# EAGLE design PicoElf (EAGLE 4.11)
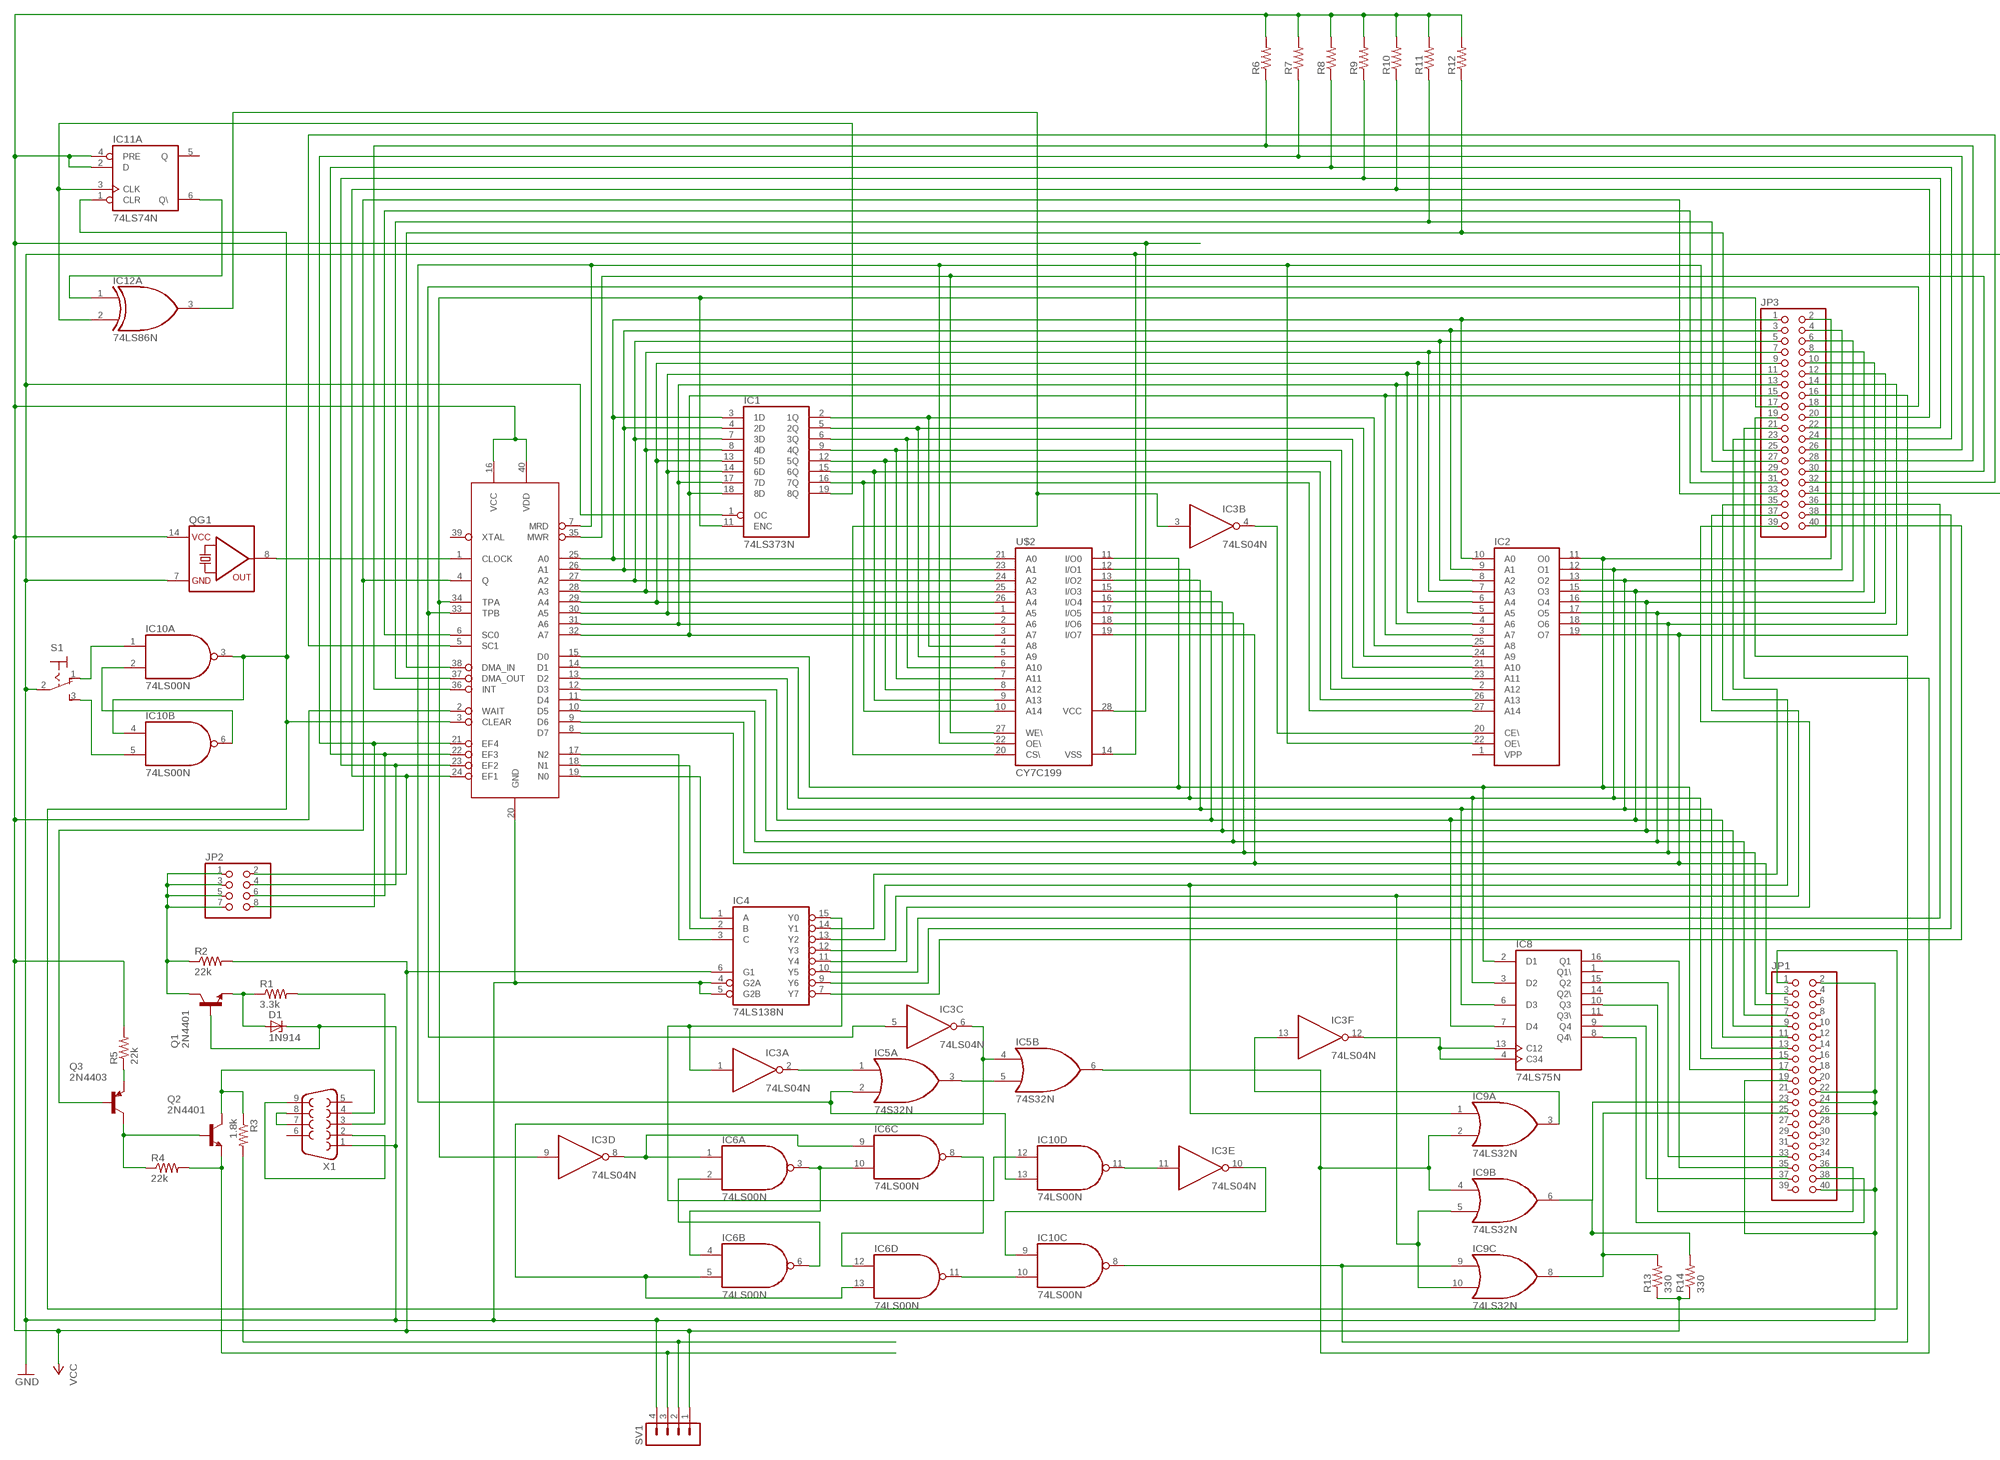
[diagram p0: schematic, sheet 1]

## Parts
D1  1N914  1N821  [DO35Z10]
IC1  74LS373N  [DIL20]
IC2  27256  [DIL28]
IC3  74LS04N  [DIL14]
IC4  74LS138N  [DIL16]
IC5  74S32N  [DIL14]
IC6  74LS00N  [DIL14]
IC8  74LS75N  [DIL16]
IC9  74LS32N  [DIL14]
IC10  74LS00N  [DIL14]
IC11  74LS74N  [DIL14]
IC12  74LS86N  [DIL14]
JP1  PINHD-2X20  [2X20]
JP2  PINHD-2X4  [2X04]
JP3  PINHD-2X20  [2X20]
Q1  2N4401  2N3565  [TO92]
Q2  2N4401  2N3565  [TO92]
Q3  2N4403  2N3906  [TO92]
QG1  QG5860  [DIL14S]
R1  3.3k  R-US_0207/5V  [0207/5V]
R2  22k  R-US_0207/5V  [0207/5V]
R3  1.8k  R-US_0207/5V  [0207/5V]
R4  22k  R-US_0207/5V  [0207/5V]
R5  22k  R-US_0207/5V  [0207/5V]
R6  R-US_0207/2V  [0207/2V]
R7  R-US_0207/2V  [0207/2V]
R8  R-US_0207/2V  [0207/2V]
R9  R-US_0207/2V  [0207/2V]
R10  R-US_0207/2V  [0207/2V]
R11  R-US_0207/2V  [0207/2V]
R12  R-US_0207/2V  [0207/2V]
R13  330  R-US_0207/2V  [0207/2V]
R14  330  R-US_0207/2V  [0207/2V]
S1  320-916  [320-916]
SV1  MA04-1  [MA04-1]
U$1  CDP1802BCECDP1802BCE  [DIL40]
U$2  CY7C199  [DIL28-3]
X1  F09H  [F09H]

## Nets
+12V: R3.2 SV1.2
-12V: Q2.3(E) R4.2 SV1.3
A0: IC1.3(1D) IC2.10(A0) JP3.1 U$1.25(A0) U$2.21(A0)
A1: IC1.4(2D) IC2.9(A1) JP3.3 U$1.26(A1) U$2.23(A1)
A2: IC1.7(3D) IC2.8(A2) JP3.5 U$1.27(A2) U$2.24(A2)
A3: IC1.8(4D) IC2.7(A3) JP3.7 U$1.28(A3) U$2.25(A3)
A4: IC1.13(5D) IC2.6(A4) JP3.9 U$1.29(A4) U$2.26(A4)
A5: IC1.14(6D) IC2.5(A5) JP3.11 U$1.30(A5) U$2.1(A5)
A6: IC1.17(7D) IC2.4(A6) JP3.13 U$1.31(A6) U$2.2(A6)
A7: IC1.18(8D) IC2.3(A7) JP3.15 U$1.32(A7) U$2.3(A7)
A8: IC1.2(1Q) IC2.25(A8) U$2.4(A8)
A9: IC1.5(2Q) IC2.24(A9) U$2.5(A9)
A10: IC1.6(3Q) IC2.21(A10) U$2.6(A10)
A11: IC1.9(4Q) IC2.23(A11) U$2.7(A11)
A12: IC1.12(5Q) IC2.2(A12) U$2.8(A12)
A13: IC1.15(6Q) IC2.26(A13) U$2.9(A13)
A14: IC1.16(7Q) IC2.27(A14) U$2.10(A14)
A15: IC1.19(8Q) IC11.3(A:CLK) IC12.2(A:I1)
CLOCK: QG1.8(OUT) U$1.1(CLOCK)
D0: IC2.11(O0) IC8.2(D1) JP1.17 JP3.2 U$1.15(D0) U$2.11(I/O0)
D1: IC2.12(O1) IC8.3(D2) JP1.15 JP3.4 U$1.14(D1) U$2.12(I/O1)
D2: IC2.13(O2) IC8.6(D3) JP1.13 JP3.6 U$1.13(D2) U$2.13(I/O2)
D3: IC2.15(O3) IC8.7(D4) JP1.11 JP3.8 U$1.12(D3) U$2.15(I/O3)
D4: IC2.16(O4) JP1.9 JP3.10 U$1.11(D4) U$2.16(I/O4)
D5: IC2.17(O5) JP1.7 JP3.12 U$1.10(D5) U$2.17(I/O5)
D6: IC2.18(O6) JP1.5 JP3.14 U$1.9(D6) U$2.18(I/O6)
D7: IC2.19(O7) JP1.3 JP3.16 U$1.8(D7) U$2.19(I/O7)
DMA_IN: JP3.25 R12.1 U$1.38(DMA_IN)
DMA_OUT: JP3.27 R11.1 U$1.37(DMA_OUT)
EF1: JP2.2 JP3.20 R10.1 U$1.24(EF1)
EF2: JP2.4 JP3.22 R9.1 U$1.23(EF2)
EF3: JP2.6 JP3.24 R8.1 U$1.22(EF3)
EF4: JP2.8 JP3.26 R7.1 U$1.21(EF4)
GND: D1.C IC1.1(OC) IC4.4(G2A) IC4.5(G2B) JP1.2 JP1.19 JP1.22 JP1.24 JP1.26 JP1.40 JP3.34 Q1.2(B) QG1.7(GND) S1.2(P) SV1.4 U$1.20(GND) U$2.14(VSS) X1.1
INP: IC9.9(C:I0) IC10.8(C:O) JP3.19
INT: JP3.28 R6.1 U$1.36(INT)
MRD: IC2.22(OE\) IC5.2(A:I1) IC10.13(D:I1) JP3.29 U$1.7(MRD) U$2.22(OE\)
MWR: JP3.30 U$1.35(MWR) U$2.27(WE\)
N$1: IC2.20(CE\) IC3.4(B:O)
N$2: IC11.6(A:Q\) IC12.1(A:I0)
N$3: IC4.1(A) U$1.19(N0)
N$4: IC4.2(B) U$1.18(N1)
N$5: IC4.3(C) U$1.17(N2)
N$6: IC3.1(A:I) IC4.15(Y0) IC10.12(D:I0)
N$7: IC3.2(A:O) IC5.1(A:I0)
N$8: IC6.3(A:O) IC6.4(B:I0) IC6.10(C:I1)
N$9: IC5.3(A:O) IC5.5(B:I1)
N$10: IC3.6(C:O) IC5.4(B:I0) IC6.5(B:I1) IC6.13(D:I1)
N$11: IC6.2(A:I1) IC6.6(B:O)
N$12: IC3.8(D:O) IC6.1(A:I0) IC6.9(C:I0)
N$13: IC3.10(E:O) IC10.9(C:I0)
N$14: IC6.8(C:O) IC6.12(D:I0)
N$15: IC3.13(F:I) IC9.3(A:O)
N$16: IC6.11(D:O) IC10.10(C:I1)
N$17: IC3.11(E:I) IC10.11(D:O)
N$19: JP3.32 U$1.5(SC1)
N$20: IC3.3(B:I) IC12.3(A:O) U$2.20(CS\)
N$23: IC3.12(F:O) IC8.4(C34) IC8.13(C12)
N$24: IC8.16(Q1) JP1.35
N$25: IC8.15(Q2) JP1.33
N$26: IC8.10(Q3) JP1.36
N$27: IC8.9(Q4) JP1.37
N$28: IC8.8(Q4\) JP1.38
N$29: IC9.6(B:O) JP1.23 R14.2
N$30: IC9.8(C:O) JP1.25 R13.2
N$31: D1.A Q1.3(E) R1.1
N$32: R1.2 X1.3
N$33: IC10.1(A:I0) S1.1(O)
N$35: X1.7 X1.8
N$36: X1.2 X1.9
N$37: JP2.1 JP2.3 JP2.5 JP2.7 Q1.1(C) R2.1
N$40: Q2.1(C) R3.1 X1.4
N$41: Q3.3(E) R5.1
N$42: Q2.2(B) Q3.1(C) R4.1
N$43: IC10.5(B:I1) S1.3(S)
N$46: IC10.2(A:I1) IC10.6(B:O)
OUT: IC5.6(B:O) IC9.2(A:I1) IC9.4(B:I0) JP3.21
PORT1: IC4.14(Y1) JP3.23
PORT2: IC4.13(Y2) IC9.1(A:I0) JP3.35
PORT3: IC4.12(Y3) IC9.5(B:I1) IC9.10(C:I1) JP3.37
PORT4: IC4.11(Y4) JP3.39
PORT5: IC4.10(Y5) JP3.36
PORT6: IC4.9(Y6) JP3.38
PORT7: IC4.7(Y7) JP3.40
Q: JP3.33 Q3.2(B) U$1.4(Q)
RESET: IC10.3(A:O) IC10.4(B:I0) IC11.1(A:CLR) JP1.1 U$1.3(CLEAR)
SC0: JP3.31 U$1.6(SC0)
TPA: IC1.11(ENC) IC3.9(D:I) JP3.17 U$1.34(TPA)
TPB: IC3.5(C:I) JP3.18 U$1.33(TPB)
VCC: IC4.6(G1) IC11.2(A:D) IC11.4(A:PRE) QG1.14(VCC) R2.2 R5.2 R6.2 R7.2 R8.2 R9.2 R10.2 R11.2 R12.2 R13.1 R14.1 SV1.1 U$1.2(WAIT) U$1.16(VCC) U$1.40(VDD) U$2.28(VCC)
Unconnected: IC2.1(VPP) IC5.8(C:O) IC5.9(C:I0) IC5.10(C:I1) IC5.11(D:O) IC5.12(D:I0) IC5.13(D:I1) IC8.1(Q1\) IC8.11(Q3\) IC8.14(Q2\) IC9.11(D:O) IC9.12(D:I0) IC9.13(D:I1) IC11.5(A:Q) IC11.8(B:Q\) IC11.9(B:Q) IC11.10(B:PRE) IC11.11(B:CLK) IC11.12(B:D) IC11.13(B:CLR) IC12.4(B:I0) IC12.5(B:I1) IC12.6(B:O) IC12.8(C:O) IC12.9(C:I0) IC12.10(C:I1) IC12.11(D:O) IC12.12(D:I0) IC12.13(D:I1) JP1.4 JP1.6 JP1.8 JP1.10 JP1.12 JP1.14 JP1.16 JP1.18 JP1.20 JP1.21 JP1.27 JP1.28 JP1.29 JP1.30 JP1.31 JP1.32 JP1.34 JP1.39 U$1.39(XTAL) X1.5 X1.6

## Power pins joined to a net without a drawn wire
GND: IC1.10(GND) IC2.14(GND) IC3.7(P:GND) IC4.8(GND) IC5.7(P:GND) IC6.7(P:GND) IC8.12(GND) IC9.7(P:GND) IC10.7(P:GND) IC11.7(P:GND) IC12.7(P:GND)
N$18: IC1.20(VCC) IC2.28(VCC) IC3.14(P:VCC) IC4.16(VCC) IC5.14(P:VCC) IC6.14(P:VCC) IC8.5(VCC) IC9.14(P:VCC) IC10.14(P:VCC) IC11.14(P:VCC) IC12.14(P:VCC)

## Library data of the parts
D1 = diode:1N821: Reference DIODE temperature compensated, 6,2 V
IC1 = 74xx-us:74*373: Octal D type transparent LATCH, edge triggered
IC2 = memory:27256: MEMORY
IC3 = 74xx-us:74*04: Hex INVERTER
IC4 = 74xx-us:74*138: 3-line to 8-line DECODER/DEMULTIPLEXER
IC5 IC9 = 74xx-us:74*32: Quad 2-input OR gate
IC6 IC10 = 74xx-us:74*00: Quad 2-input NAND gate
IC8 = 74xx-us:74*75: 4-bit bistable LATCH
IC11 = 74xx-us:74*74: Dual D type positive edge triggered FLIP FLOP, preset and clear
IC12 = 74xx-us:74*86: Quad 2-input EXCLUSIV-OR (XOR) gate
JP1 JP3 = pinhead:PINHD-2X20: PIN HEADER
JP2 = pinhead:PINHD-2X4: PIN HEADER
Q1 Q2 = transistor-npn:2N3565: NPN Transistor
Q3 = transistor-pnp:2N3906: PNP Transistor
QG1 = crystal:QG5860: CRYSTAL RESONATOR
R1-R14 = rcl:R-US_: RESISTOR, American symbol
S1 = switch:320-916: TOGGLE SWITCH distributor RS Components
SV1 = con-lstb:MA04-1: PIN HEADER
U$1 = cdp:CDP1802BCE
U$2 = cdp:CY7C199
X1 = con-subd:F09: SUB-D

## Board
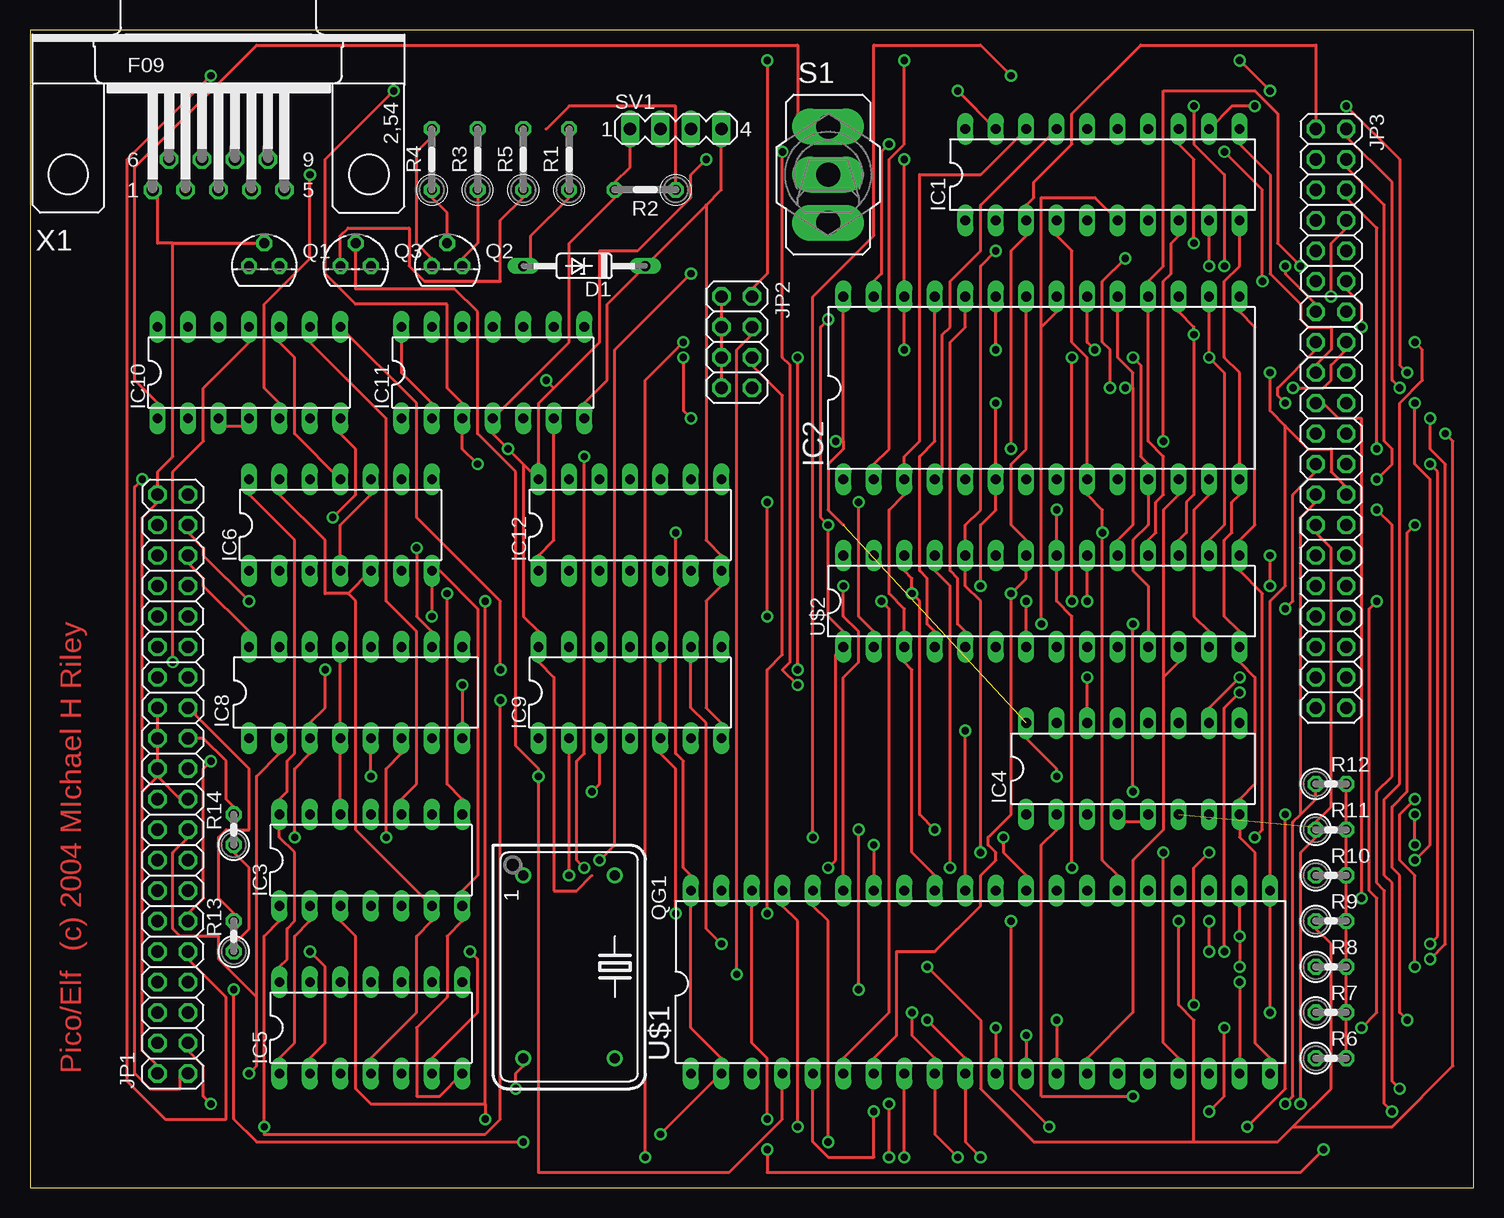
[diagram p1: board, top side]
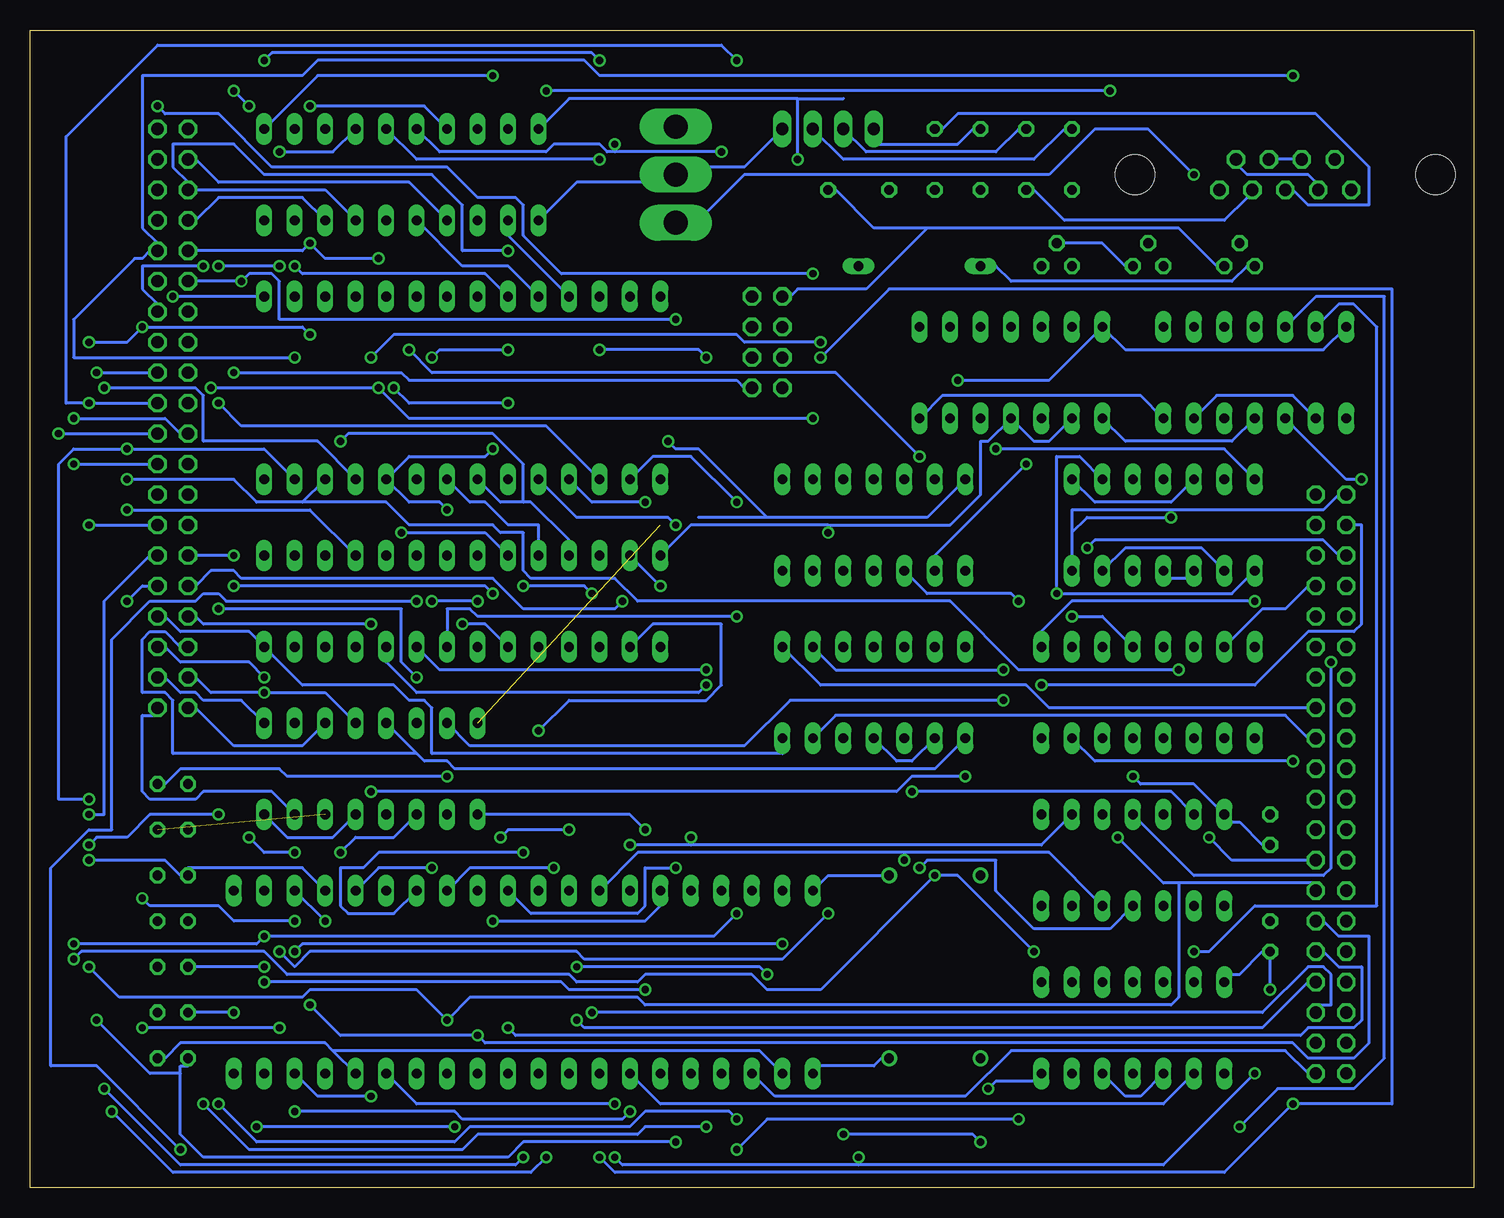
[diagram p2: board, bottom side, seen from below]

Size 120.32 x 96.51 mm. Coordinates in mm from the lower left corner, seen from the top.
Outline: 0,0 120.32,0 120.32,96.51 0,96.51 0,0
Copper layers (1*16): Top 0.035mm / dielectric 1.5mm / Bottom 0.035mm
Design rules "default": minimum track width 10mil, minimum drill 24mil, track to track 8mil, track to pad 8mil, pad to pad 8mil, via to via 8mil, smd to smd 8mil, copper to edge 40mil, drill to drill 8mil, minimum pad ring 10mil, minimum via ring 8mil, stop-mask expansion 4mil, vias tented up to drill 0mil, thermal gap 10mil

### Footprints (pad centres in the part's own frame; a part is rotated, then mirrored left to right if it is on the bottom)
DO35Z10 = drill 0.813 long: A 5.08,0; C -5.08,0
DIL20 = drill 0.813 long: 1 -11.43,-3.81; 2 -8.89,-3.81; 3 -6.35,-3.81; 4 -3.81,-3.81; 5 -1.27,-3.81; 6 1.27,-3.81; 7 3.81,-3.81; 8 6.35,-3.81; 9 8.89,-3.81; 10 11.43,-3.81; 11 11.43,3.81; 12 8.89,3.81; 13 6.35,3.81; 14 3.81,3.81; 15 1.27,3.81; 16 -1.27,3.81; 17 -3.81,3.81; 18 -6.35,3.81; 19 -8.89,3.81; 20 -11.43,3.81
DIL28 = drill 0.813 long: 1 -16.51,-7.62; 2 -13.97,-7.62; 3 -11.43,-7.62; 4 -8.89,-7.62; 5 -6.35,-7.62; 6 -3.81,-7.62; 7 -1.27,-7.62; 8 1.27,-7.62; 9 3.81,-7.62; 10 6.35,-7.62; 11 8.89,-7.62; 12 11.43,-7.62; 13 13.97,-7.62; 14 16.51,-7.62; 15 16.51,7.62; 16 13.97,7.62; 17 11.43,7.62; 18 8.89,7.62; 19 6.35,7.62; 20 3.81,7.62; 21 1.27,7.62; 22 -1.27,7.62; 23 -3.81,7.62; 24 -6.35,7.62; 25 -8.89,7.62; 26 -11.43,7.62; 27 -13.97,7.62; 28 -16.51,7.62
DIL14 = drill 0.813 long: 1 -7.62,-3.81; 2 -5.08,-3.81; 3 -2.54,-3.81; 4 0,-3.81; 5 2.54,-3.81; 6 5.08,-3.81; 7 7.62,-3.81; 8 7.62,3.81; 9 5.08,3.81; 10 2.54,3.81; 11 0,3.81; 12 -2.54,3.81; 13 -5.08,3.81; 14 -7.62,3.81
DIL16 = drill 0.813 long: 1 -8.89,-3.81; 2 -6.35,-3.81; 3 -3.81,-3.81; 4 -1.27,-3.81; 5 1.27,-3.81; 6 3.81,-3.81; 7 6.35,-3.81; 8 8.89,-3.81; 9 8.89,3.81; 10 6.35,3.81; 11 3.81,3.81; 12 1.27,3.81; 13 -1.27,3.81; 14 -3.81,3.81; 15 -6.35,3.81; 16 -8.89,3.81
2X20 = drill 1.016 octagon: 1 -24.13,-1.27; 2 -24.13,1.27; 3 -21.59,-1.27; 4 -21.59,1.27; 5 -19.05,-1.27; 6 -19.05,1.27; 7 -16.51,-1.27; 8 -16.51,1.27; 9 -13.97,-1.27; 10 -13.97,1.27; 11 -11.43,-1.27; 12 -11.43,1.27; 13 -8.89,-1.27; 14 -8.89,1.27; 15 -6.35,-1.27; 16 -6.35,1.27; 17 -3.81,-1.27; 18 -3.81,1.27; 19 -1.27,-1.27; 20 -1.27,1.27; 21 1.27,-1.27; 22 1.27,1.27; 23 3.81,-1.27; 24 3.81,1.27; 25 6.35,-1.27; 26 6.35,1.27; 27 8.89,-1.27; 28 8.89,1.27; 29 11.43,-1.27; 30 11.43,1.27; 31 13.97,-1.27; 32 13.97,1.27; 33 16.51,-1.27; 34 16.51,1.27; 35 19.05,-1.27; 36 19.05,1.27; 37 21.59,-1.27; 38 21.59,1.27; 39 24.13,-1.27; 40 24.13,1.27
2X04 = drill 1.016 octagon: 1 -3.81,-1.27; 2 -3.81,1.27; 3 -1.27,-1.27; 4 -1.27,1.27; 5 1.27,-1.27; 6 1.27,1.27; 7 3.81,-1.27; 8 3.81,1.27
TO92 = drill 0.813 octagon: 1 1.27,0; 2 0,1.905; 3 -1.27,0
DIL14S = drill 0.813 round: 1 -7.62,-3.81; 7 7.62,-3.81; 8 7.62,3.81; 14 -7.62,3.81
0207/5V = drill 0.813 octagon: 1 -2.54,0; 2 2.54,0
0207/2V = drill 0.813 octagon: 1 -1.27,0; 2 1.27,0
320-916 = drill 2.007 long: 1 0,4.013; 2 0,0; 3 0,-4.013
MA04-1 = drill 1.016 long: 1 -3.81,0; 2 -1.27,0; 3 1.27,0; 4 3.81,0
DIL40 = drill 0.813 long: 1 -24.13,-7.62; 2 -21.59,-7.62; 3 -19.05,-7.62; 4 -16.51,-7.62; 5 -13.97,-7.62; 6 -11.43,-7.62; 7 -8.89,-7.62; 8 -6.35,-7.62; 9 -3.81,-7.62; 10 -1.27,-7.62; 11 1.27,-7.62; 12 3.81,-7.62; 13 6.35,-7.62; 14 8.89,-7.62; 15 11.43,-7.62; 16 13.97,-7.62; 17 16.51,-7.62; 18 19.05,-7.62; 19 21.59,-7.62; 20 24.13,-7.62; 21 24.13,7.62; 22 21.59,7.62; 23 19.05,7.62; 24 16.51,7.62; 25 13.97,7.62; 26 11.43,7.62; 27 8.89,7.62; 28 6.35,7.62; 29 3.81,7.62; 30 1.27,7.62; 31 -1.27,7.62; 32 -3.81,7.62; 33 -6.35,7.62; 34 -8.89,7.62; 35 -11.43,7.62; 36 -13.97,7.62; 37 -16.51,7.62; 38 -19.05,7.62; 39 -21.59,7.62; 40 -24.13,7.62
DIL28-3 = drill 0.813 long: 1 -16.51,-3.81; 2 -13.97,-3.81; 3 -11.43,-3.81; 4 -8.89,-3.81; 5 -6.35,-3.81; 6 -3.81,-3.81; 7 -1.27,-3.81; 8 1.27,-3.81; 9 3.81,-3.81; 10 6.35,-3.81; 11 8.89,-3.81; 12 11.43,-3.81; 13 13.97,-3.81; 14 16.51,-3.81; 15 16.51,3.81; 16 13.97,3.81; 17 11.43,3.81; 18 8.89,3.81; 19 6.35,3.81; 20 3.81,3.81; 21 1.27,3.81; 22 -1.27,3.81; 23 -3.81,3.81; 24 -6.35,3.81; 25 -8.89,3.81; 26 -11.43,3.81; 27 -13.97,3.81; 28 -16.51,3.81
F09H = drill 1.016 octagon: 1 -5.486,-1.27; 2 -2.743,-1.27; 3 0,-1.27; 4 2.743,-1.27; 5 5.486,-1.27; 6 -4.115,1.27; 7 -1.372,1.27; 8 1.372,1.27; 9 4.115,1.27 | hole 3.302: -12.522,0; 12.522,0

### Placement (x,y rotation side)
D1  46.19,76.83 180 top
IC1  89.37,84.45 0 top
IC2  84.29,66.67 0 top
IC3  28.41,27.3 0 top
IC4  91.91,34.92 0 top
IC5  28.41,13.33 0 top
IC6  25.87,55.24 0 top
IC8  27.14,41.27 0 top
IC9  50,41.27 0 top
IC10  18.25,67.94 0 top
IC11  38.57,67.94 0 top
IC12  50,55.24 0 top
JP1  11.9,33.65 90 top
JP2  58.89,70.48 270 top
JP3  108.42,64.13 270 top
Q1  19.52,76.83 0 top
Q2  34.76,76.83 0 top
Q3  27.14,76.83 0 top
QG1  44.92,18.41 270 top
R1  44.92,85.72 90 top
R2  51.27,83.18 180 top
R3  37.3,85.72 90 top
R4  33.49,85.72 90 top
R5  41.11,85.72 90 top
R6  108.42,10.79 0 top
R7  108.42,14.6 0 top
R8  108.42,18.41 0 top
R9  108.42,22.22 0 top
R10  108.42,26.03 0 top
R11  108.42,29.84 0 top
R12  108.42,33.65 0 top
R13  16.98,20.95 90 top
R14  16.98,29.84 90 top
S1  66.51,84.45 0 top
SV1  53.81,88.26 0 top
U$1  79.21,17.14 0 top
U$2  84.29,48.89 0 top
X1  15.71,84.45 0 top

### Tracks (layer width: path | path; a pad name or v marks a point on that pad's centre or on a via)
+12V
  Bottom 0.254: R3.2 37.94,88.26 39.84,86.36 50.63,86.36 SV1.2
-12V
  Top 0.254: Q2.3 33.49,77.47 32.22,78.73 32.22,86.36 33.49,87.62 R4.2
  Bottom 0.254: SV1.3 52.54,85.72 36.66,85.72 34.12,88.26 R4.2
A0  (via drill 0.61)
  Top 0.254: JP3.1 107.15,95.25 92.55,95.25 86.83,89.53 86.83,86.99 83.66,83.81 83.66,82.55 83.02,81.91 IC1.3 83.02,79.37 81.75,78.1 v81.75,61.59 | v85.56,56.51 U$2.21 85.56,48.89 86.83,47.62 v86.83,26.66
  Bottom 0.254: v85.56,56.51 86.19,57.15 88.73,57.15 IC2.10 88.73,60.95 82.39,60.95 v81.75,61.59 | v86.83,26.66 91.28,26.66 U$1.25
A1  (via drill 0.61)
  Top 0.254: U$1.26 90.64,26.03 89.37,27.3 v89.37,54.6 89.37,56.51 88.1,57.78 IC2.9 88.1,69.21 86.83,70.48 86.83,78.1 85.56,79.37 IC1.4
  Bottom 0.254: v89.37,54.6 82.39,54.6 U$2.23 | JP3.3 106.52,85.72 104.61,83.81 88.73,83.81 IC1.4
A2  (via drill 0.61)
  Top 0.254: v79.21,27.93 79.21,48.89 77.94,50.16 U$2.24 77.94,55.24 79.21,56.51 79.21,76.83 v80.48,78.1
  Bottom 0.254: IC1.7 95.72,83.18 JP3.5 107.15,83.81 108.42,85.08 108.42,86.99 103.34,86.99 100.8,84.45 86.83,84.45 84.29,81.91 84.29,78.1 v80.48,78.1 | U$2.24 77.94,55.24 80.48,55.24 82.39,57.15 83.66,57.15 IC2.8 | v79.21,27.93 91.28,27.93 92.55,26.66 94.45,26.66 94.45,23.49 93.81,22.86 90,22.86 U$1.27
A3  (via drill 0.61)
  Top 0.254: v76.67,26.66 76.67,50.16 75.4,51.43 U$2.25 | v94.45,62.23 94.45,75.56 95.08,76.19 95.08,78.73 95.72,79.37 IC1.8
  Bottom 0.254: IC1.8 97.62,82.55 104.61,82.55 106.52,80.64 JP3.7 | 79.21,57.15 81.11,57.15 IC2.7 | 79.21,57.15 78.58,57.15 75.4,53.97 U$2.25 | v76.67,26.66 83.66,26.66 U$1.28 | v94.45,62.23 93.81,62.86 81.75,62.86 79.21,60.32 79.21,57.15
A4  (via drill 0.61)
  Top 0.254: v96.99,78.73 96.99,85.72 95.72,86.99 IC1.13 | v79.21,50.16 79.21,55.24 80.48,56.51 IC2.6 v80.48,65.4 | U$2.26 72.86,51.43 73.5,50.8 v73.5,49.52 74.13,48.89 74.13,31.11 v75.4,29.84 | v81.11,29.2 81.11,27.93 83.02,26.03 U$1.29 | v91.28,77.47 89.37,75.56 89.37,70.48 90,69.84 v90,66.67
  Bottom 0.254: JP3.9 97.62,78.1 v96.99,78.73 95.72,77.47 v91.28,77.47 | v73.5,49.52 74.13,50.16 v79.21,50.16 | v81.11,29.2 80.48,29.84 v75.4,29.84 | v90,66.67 88.73,65.4 v80.48,65.4
A5  (via drill 0.61)
  Top 0.254: v99.53,86.36 102.7,83.18 v102.7,75.56 | v66.51,26.66 67.14,27.3 67.14,44.45 U$2.1 67.78,46.35 66.51,47.62 v66.51,55.24 65.88,55.88 65.88,71.75 v66.51,72.39
  Bottom 0.254: v99.53,86.36 95.08,86.36 IC1.14 | JP3.11 v102.7,75.56 102.07,76.19 100.17,76.19 99.53,75.56 99.53,72.39 v66.51,72.39 | v66.51,55.24 67.14,55.88 74.77,55.88 IC2.5 | v66.51,26.66 69.05,26.66 69.05,23.49 69.69,22.86 78.58,22.86 U$1.30
A6  (via drill 0.61)
  Top 0.254: v69.05,57.15 69.05,47.62 70.32,46.35 U$2.2 | U$1.31 v77.94,38.09 | IC1.17 79.21,81.91 79.21,78.1 76.67,75.56 76.67,71.75 76.03,71.12 76.03,59.69 IC2.4 | v104.61,76.83 104.61,76.19 107.15,73.66 JP3.13 | v99.53,76.83 99.53,84.45 96.99,86.99 v96.99,90.17
  Bottom 0.254: v69.05,57.15 73.5,57.15 IC2.4 | v77.94,38.09 75.4,40.63 63.97,40.63 62.7,41.91 62.7,46.98 68.41,46.98 U$2.2 | v99.53,76.83 v104.61,76.83 | v96.99,90.17 87.47,90.17 IC1.17
A7  (via drill 0.61)
  Top 0.254: U$1.32 75.4,26.03 73.5,27.93 73.5,43.17 72.86,43.81 U$2.3 72.86,48.26 71.59,49.52 71.59,56.51 72.86,57.78 IC2.3 72.86,60.95 74.13,62.23 74.13,84.45 79.21,84.45 IC1.18 | v104.61,65.4 103.97,66.03 103.97,66.67 107.15,69.84 JP3.15
  Bottom 0.254: v104.61,65.4 102.7,63.49 77.3,63.49 IC2.3
A8
  Top 0.254: U$2.4 75.4,46.35 74.77,46.98 74.77,50.8 74.13,51.43 74.13,60.95 75.4,62.23 IC2.25
  Bottom 0.254: IC1.2 80.48,79.37 IC2.25
A9
  Top 0.254: U$2.5 77.94,46.35 77.3,46.98 77.3,50.8 76.67,51.43 76.67,70.48 77.94,71.75 IC2.24
  Bottom 0.254: IC1.5 84.29,76.83 80.48,76.83 IC2.24
A10  (via drill 0.61)
  Top 0.254: v84.29,46.98 84.29,71.75 | 84.29,71.75 85.56,73.02 IC2.21 | 84.29,71.75 84.29,82.55 88.73,82.55 IC1.6
  Bottom 0.254: v84.29,46.98 82.39,46.98 U$2.6
A11  (via drill 0.61)
  Top 0.254: v86.83,48.89 v86.83,69.21 | U$2.7 v83.02,48.89 | v80.48,69.84 IC2.23 | v98.26,76.83 IC1.9
  Bottom 0.254: v83.02,48.89 v86.83,48.89 | v86.83,69.21 86.19,69.84 v80.48,69.84 | v98.26,76.83 97.62,76.19 82.39,76.19 IC2.23
A12  (via drill 0.61)
  Top 0.254: v61.43,47.62 v61.43,57.15 | v102.07,90.17 100.17,90.17 IC1.12 | v100.8,93.97 v103.34,91.44 | v72.86,93.97 72.86,86.99 71.59,85.72 71.59,61.59 70.32,60.32 IC2.2
  Bottom 0.254: v61.43,47.62 83.02,47.62 83.66,48.26 85.56,48.26 U$2.8 | v61.43,57.15 65.24,60.95 68.41,60.95 IC2.2 | v103.34,91.44 v102.07,90.17 | v100.8,93.97 100.17,94.61 73.5,94.61 v72.86,93.97
A13  (via drill 0.61)
  Top 0.254: v63.97,43.17 v63.97,69.21 | v72.86,69.84 IC2.26 v72.86,85.72
  Bottom 0.254: v63.97,43.17 86.19,43.17 U$2.9 | v63.97,69.21 64.6,69.84 v72.86,69.84 | v72.86,85.72 88.1,85.72 IC1.15
A14  (via drill 0.61)
  Top 0.254: v63.97,41.91 62.7,43.17 63.34,43.81 63.34,68.58 62.7,69.21 v62.7,86.36 | v71.59,86.99 70.95,86.36 70.95,76.19 70.32,75.56 IC2.27
  Bottom 0.254: v63.97,41.91 64.6,41.27 88.1,41.27 90.64,43.81 U$2.10 | 71.59,86.36 72.22,86.36 72.86,86.99 76.67,86.99 77.3,86.36 86.19,86.36 IC1.16 | v62.7,86.36 71.59,86.36 | 71.59,86.36 v71.59,86.99
A15  (via drill 0.61)
  Top 0.254: v37.3,60.32 36.03,61.59 IC11.3 36.03,65.4 34.76,66.67 34.76,73.66 27.14,73.66 24.6,76.19 24.6,85.72 v30.31,91.44 | v77.3,91.44 IC1.19
  Bottom 0.254: v37.3,60.32 44.92,52.7 IC12.2 | v30.31,91.44 v77.3,91.44
CLOCK
  Bottom 0.254: QG1.8 49.37,10.79 50,10.15 54.45,10.15 U$1.1
D0  (via drill 0.61)
  Top 0.254: U$2.11 93.18,50.16 91.91,51.43 91.91,53.97 93.18,55.24 IC2.11 93.18,60.32 92.55,60.95 92.55,68.58 v91.91,69.21 | v114.14,66.67 113.5,67.31 113.5,83.81 109.69,87.62 JP3.2 | v71.59,2.54 v71.59,6.98 | v18.25,9.52 18.88,10.15 18.88,15.87 | 18.88,15.87 18.88,34.28 20.79,36.19 IC8.2 | 18.88,15.87 15.71,19.05 15.71,20.95 12.54,20.95 11.9,21.59 11.9,27.93 13.17,29.2 JP1.17 | v54.45,70.48 51.27,67.31 v51.27,2.54
  Bottom 0.254: v114.14,66.67 106.52,66.67 105.88,66.03 105.88,62.23 96.36,62.23 IC2.11 | v71.59,6.98 88.1,6.98 U$1.15 | v71.59,2.54 70.95,1.9 51.27,1.9 | 51.27,1.9 25.87,1.9 v18.25,9.52 | v91.91,69.21 90,71.12 61.43,71.12 60.8,70.48 v54.45,70.48 | 51.27,1.9 v51.27,2.54
D1  (via drill 0.61)
  Top 0.254: v22.06,29.2 22.06,34.92 23.33,36.19 IC8.3 23.33,38.73 24.6,40 v24.6,43.17 | 94.45,42.54 94.45,29.84 91.91,27.3 91.91,14.6 88.1,10.79 U$1.14 | 94.45,42.54 95.72,43.81 U$2.12 | 94.45,42.54 94.45,56.51 95.72,57.78 IC2.12 | v112.23,59.05 113.5,60.32 113.5,61.59 112.86,62.23 112.86,81.91 109.69,85.08 JP3.4
  Bottom 0.254: v22.06,29.2 20.16,27.3 JP1.15 | v112.23,59.05 103.34,59.05 101.44,57.15 97.62,57.15 | 97.62,57.15 IC2.12 | v24.6,43.17 37.94,43.17 43.65,48.89 69.69,48.89 71.59,50.8 78.58,50.8 79.21,51.43 79.21,54.6 81.11,54.6 81.75,55.24 88.73,55.24 90.64,57.15 97.62,57.15
D2  (via drill 0.61)
  Top 0.254: U$2.13 98.26,46.35 96.99,47.62 96.99,56.51 98.26,57.78 IC2.13 | v112.23,61.59 112.23,80 109.69,82.55 JP3.6 | v85.56,13.96 U$1.13 | v29.68,29.2 29.68,34.92 30.95,36.19 IC8.6 | v115.41,32.38 114.14,31.11 114.14,27.3 115.41,26.03 v115.41,18.41
  Bottom 0.254: IC2.13 100.8,61.59 v112.23,61.59 116.67,61.59 117.94,60.32 117.94,32.38 v115.41,32.38 | 24.6,25.39 24.6,15.87 25.23,15.23 69.05,15.23 69.69,15.87 83.66,15.87 v85.56,13.96 88.1,16.51 96.99,16.51 97.62,15.87 112.86,15.87 v115.41,18.41 | 24.6,25.39 13.17,25.39 JP1.13 | v29.68,29.2 25.87,25.39 24.6,25.39
D3  (via drill 0.61)
  Top 0.254: IC2.15 100.8,73.02 102.07,71.75 102.07,55.24 100.8,53.97 U$2.15 100.8,51.43 102.7,49.52 102.7,29.84 v102.07,29.2 | v108.42,74.29 108.42,78.73 109.69,80 JP3.8 | v15.07,35.55 14.44,34.92 14.44,24.12 13.17,22.86 JP1.11 | v83.02,12.7 U$1.12 | v98.26,27.93 96.99,26.66 v96.99,15.23
  Bottom 0.254: IC2.15 v108.42,74.29 | v15.07,35.55 31.59,35.55 IC8.7 | JP1.11 12.54,22.22 11.26,20.95 8.72,20.95 8.72,12.06 9.99,10.79 13.8,10.79 15.07,12.06 82.39,12.06 v83.02,12.7 94.45,12.7 v96.99,15.23 | v102.07,29.2 100.8,27.93 v98.26,27.93
D4  (via drill 0.61)
  Top 0.254: U$2.16 98.26,53.97 99.53,55.24 99.53,67.94 v98.26,69.21 IC2.16 | v80.48,13.33 U$1.11 | v15.07,92.7 8.09,85.72 8.09,8.88 11.26,5.71 16.34,5.71 16.34,15.87 13.17,19.05 JP1.9
  Bottom 0.254: v98.26,69.21 116.67,69.21 116.67,72.39 111.59,77.47 110.96,77.47 110.33,78.1 JP3.10 109.69,78.73 110.96,80 110.96,92.7 97.62,92.7 96.36,93.97 74.13,93.97 72.86,92.7 v15.07,92.7 | v80.48,13.33 79.84,12.7 14.44,12.7 13.8,13.33 9.99,13.33 9.36,13.96 9.36,18.41 11.26,18.41 12.54,19.68 JP1.9
D5  (via drill 0.61)
  Top 0.254: U$2.17 95.72,53.97 96.36,54.6 96.36,57.15 96.99,57.78 v96.99,71.12 96.99,71.75 95.72,73.02 IC2.17 | v110.96,71.75 110.96,73.66 109.69,74.92 JP3.12 | v74.77,13.96 77.94,10.79 U$1.10 77.94,3.8 v79.21,2.54 | v115.41,70.48 116.04,69.84 116.04,67.31 114.14,65.4 114.14,33.65 112.86,32.38 112.86,26.03 113.5,25.39 113.5,8.88 v114.14,8.25
  Bottom 0.254: v96.99,71.12 97.62,71.75 v110.96,71.75 112.23,70.48 v115.41,70.48 | v74.77,13.96 74.13,13.33 17.62,13.33 13.8,17.14 JP1.7 | v114.14,8.25 107.78,1.9 79.84,1.9 v79.21,2.54
D6  (via drill 0.61)
  Top 0.254: U$2.18 93.18,53.97 93.81,54.6 93.81,57.15 94.45,57.78 94.45,60.95 93.18,62.23 IC2.18 93.18,75.56 94.45,76.83 94.45,91.44 102.07,91.44 103.97,89.53 103.97,78.73 v105.88,76.83 | v73.5,14.6 73.5,12.7 75.4,10.79 U$1.9 75.4,4.44 v77.3,2.54 | v112.23,56.51 113.5,55.24 113.5,34.28 112.23,33.02 112.23,25.39 112.86,24.76 112.86,6.98 v113.5,6.34
  Bottom 0.254: v105.88,76.83 110.96,76.83 110.96,74.92 109.69,73.66 JP3.14 | v73.5,14.6 17.62,14.6 13.8,18.41 12.54,18.41 11.9,17.77 11.9,15.23 13.17,15.23 JP1.5 | v112.23,56.51 96.99,56.51 U$2.18 | v113.5,6.34 108.42,1.26 78.58,1.26 v77.3,2.54
D7  (via drill 0.61)
  Top 0.254: 91.91,66.67 91.91,67.94 90.64,69.21 IC2.19 | 91.91,66.67 91.91,55.24 90.64,53.97 U$2.19 | v105.25,66.67 107.78,66.67 108.42,67.31 108.42,68.58 109.69,69.84 JP3.16 | v91.28,66.67 91.91,66.67 | v15.07,6.98 14.44,7.62 14.44,10.15 13.17,11.43 JP1.3 | v72.86,2.54 U$1.8 | v55.08,64.13 54.45,64.77 v54.45,69.21
  Bottom 0.254: v105.25,66.67 v91.28,66.67 88.73,64.13 v55.08,64.13 | v72.86,2.54 71.59,1.26 20.79,1.26 v15.07,6.98 6.82,6.98 6.82,74.92 48.73,74.92 v54.45,69.21
DMA_IN  (via drill 0.61)
  Top 0.254: v61.43,5.71 61.43,10.79 60.16,12.06 U$1.38 | v104.61,6.98 105.25,7.62 105.25,30.48 105.88,31.11 | 105.88,31.11 107.15,32.38 R12.1 | 105.88,31.11 105.88,55.88 107.15,57.15 JP3.25
  Bottom 0.254: v61.43,5.71 62.06,6.34 69.05,6.34 70.32,5.08 83.66,5.08 84.92,3.8 101.44,3.8 v104.61,6.98
DMA_OUT  (via drill 0.61)
  Top 0.254: v63.97,5.08 63.97,22.22 62.7,23.49 U$1.37 | v105.88,6.98 105.88,27.93 107.15,29.2 R11.1 107.15,30.48 108.42,31.75 108.42,53.34 107.15,54.6 JP3.27
  Bottom 0.254: v63.97,5.08 69.05,5.08 69.69,4.44 83.02,4.44 84.29,3.17 102.07,3.17 v105.88,6.98
EF1  (via drill 0.61)
  Top 0.254: v61.43,93.97 61.43,76.19 60.16,74.92 JP2.2 | v115.41,27.3 116.67,28.57 116.67,59.05 115.41,60.32 v115.41,65.4
  Bottom 0.254: U$1.24 97.62,26.66 107.15,26.66 R10.1 107.78,26.03 109.05,27.3 v115.41,27.3 | v61.43,93.97 62.7,95.25 109.69,95.25 117.31,87.62 117.31,65.4 v115.41,65.4 JP3.20
EF2  (via drill 0.61)
  Top 0.254: 105.25,5.08 103.97,3.8 96.99,3.8 | 105.25,5.08 108.42,8.25 108.42,20.31 107.15,21.59 R9.1 | 96.99,3.8 96.99,13.96 95.72,15.23 v95.72,22.22 | v58.89,17.77 58.89,69.84 60.16,71.12 JP2.4 | v74.77,18.41 79.21,13.96 79.21,8.25 83.66,3.8 96.99,3.8 | v117.94,62.86 118.58,62.23 118.58,10.15 113.5,5.08 105.25,5.08
  Bottom 0.254: v95.72,22.22 U$1.23 | v58.89,17.77 59.52,18.41 v74.77,18.41 | v117.94,62.86 JP3.22
EF3  (via drill 0.61)
  Top 0.254: v100.8,18.41 v100.8,20.95 U$1.22 | v61.43,22.86 61.43,43.17 62.7,44.45 62.7,66.03 60.16,68.58 JP2.6 | v116.67,60.32 117.31,59.69 117.31,20.95 v116.67,20.31
  Bottom 0.254: v100.8,18.41 R8.1 | v61.43,22.86 63.34,20.95 v100.8,20.95 101.44,20.31 v116.67,20.31 | v116.67,60.32 JP3.24
EF4  (via drill 0.61)
  Top 0.254: v103.34,14.6 U$1.21 103.34,48.89 104.61,50.16 104.61,63.49 | v103.34,67.94 103.34,64.77 104.61,63.49 | 104.61,63.49 106.52,61.59 108.42,61.59 108.42,59.69 109.69,58.41 JP3.26
  Bottom 0.254: v103.34,14.6 R7.1 | v103.34,67.94 89.37,67.94 88.73,67.31 61.43,67.31 60.8,66.67 JP2.8
GND  (via drill 0.61)
  Top 0.254: IC5.7 34.12,7.62 32.22,7.62 32.22,13.33 34.76,15.87 34.76,20.95 36.03,22.22 IC3.7 36.03,24.76 37.3,26.03 37.3,48.26 34.12,51.43 IC6.7 v33.49,47.62 | v40.47,8.25 40.47,9.52 41.11,10.15 QG1.7 | 11.9,78.73 10.63,78.73 10.63,82.55 X1.1 | 11.9,78.73 Q1.2 | 9.36,33.02 9.36,11.43 10.63,10.15 JP1.2 | 9.36,33.02 10.63,34.28 | JP1.26 JP1.24 JP1.22 10.63,34.28 | 9.36,33.02 9.36,55.88 10.63,57.15 JP1.40 10.63,59.69 11.9,60.95 11.9,78.73 | 10.63,34.28 12.54,32.38 JP1.19 | IC4.4 91.28,30.48 92.55,30.48 IC4.5 | U$1.20 103.34,10.79 102.07,12.06 102.07,27.93 100.8,29.2 IC4.8 100.8,32.38 102.07,33.65 102.07,42.54 100.8,43.81 U$2.14 100.8,46.35 99.53,47.62 99.53,53.97 100.17,54.6 100.17,57.15 100.8,57.78 IC2.14 100.8,67.94 99.53,69.21 99.53,75.56 100.8,76.83 IC1.10 | IC9.7 57.62,38.73 56.35,40 56.35,48.89 57.62,50.16 IC12.7 57.62,52.7 56.35,53.97 56.35,81.91 | 56.35,81.91 57.62,83.18 SV1.4 | 56.35,81.91 D1.C 48.09,73.66 48.09,67.31 46.19,65.4 IC11.7 | v25.23,55.88 27.14,57.78 27.14,61.59 25.87,62.86 IC10.7
  Bottom 0.254: v40.47,8.25 39.84,8.88 36.66,8.88 IC5.7 | v33.49,47.62 30.95,47.62 IC8.12 | 33.49,54.6 33.49,56.51 12.54,56.51 11.26,57.78 JP1.40 | 33.49,54.6 IC6.7 | IC4.8 98.89,29.2 95.08,29.2 IC4.5 | JP3.34 109.05,47.62 107.78,46.35 102.07,46.35 U$2.14 97.62,41.91 90,41.91 88.73,40.63 87.47,40.63 86.83,40 86.83,36.19 57.62,36.19 IC9.7 | IC10.7 27.77,66.03 44.28,66.03 IC11.7 | IC1.1 74.77,83.81 69.05,83.81 S1.2 63.97,85.08 60.8,85.08 SV1.4 | 33.49,54.6 32.22,55.88 v25.23,55.88
INP  (via drill 0.61)
  Top 0.254: v39.2,43.17 39.2,48.89 32.22,55.88 32.22,65.4 IC10.8 | v110.96,24.12 110.96,64.13 109.05,64.13 107.78,65.4 JP3.19 | v98.26,19.68 v98.26,22.22 | v57.62,20.31 56.35,21.59 56.35,38.73 55.08,40 IC9.9
  Bottom 0.254: v39.2,43.17 53.17,43.17 IC9.9 | v110.96,24.12 110.33,23.49 104.61,23.49 103.34,22.22 v98.26,22.22 | v98.26,19.68 97.62,20.31 v57.62,20.31
INT  (via drill 0.61)
  Top 0.254: v66.51,3.8 66.51,22.22 65.24,23.49 U$1.36 | v115.41,55.24 114.77,54.6 114.77,33.02 113.5,31.75 113.5,26.66 114.14,26.03 114.14,14.6 v114.77,13.96
  Bottom 0.254: v66.51,3.8 79.21,3.8 80.48,2.54 105.88,2.54 107.78,4.44 107.78,9.52 | 107.78,9.52 107.78,10.15 107.15,10.15 R6.1 | v114.77,13.96 110.33,9.52 107.78,9.52 | v115.41,55.24 JP3.28
MRD  (via drill 0.61)
  Top 0.254: IC2.22 83.02,61.59 81.75,60.32 81.75,55.24 83.02,53.97 U$2.22 83.02,50.8 v81.75,49.52 81.75,31.11 79.84,29.2 79.84,28.57 80.48,27.93 80.48,27.3 79.21,26.03 79.21,23.49 75.4,19.68 72.22,19.68 72.22,12.7 70.32,10.79 U$1.7 | v103.34,50.16 v103.34,52.7 | v23.33,19.68 24.6,18.41 24.6,12.06 23.33,10.79 IC5.2
  Bottom 0.254: v103.34,50.16 82.39,50.16 v81.75,49.52 | v103.34,52.7 JP3.29 | IC5.2 25.87,6.98 67.78,6.98 U$1.7 | v23.33,19.68 22.06,19.68 18.25,23.49 8.09,23.49 8.09,71.75 9.99,73.66 11.26,73.66 IC10.13
MWR  (via drill 0.61)
  Top 0.254: v67.78,50.16 67.78,47.62 69.05,46.35 69.05,43.81 67.78,42.54 U$1.35 | v115.41,28.57 v115.41,31.11 | v104.61,31.11 104.61,8.25 v101.44,5.08 | v84.92,5.08 81.75,8.25 v81.75,22.22
  Bottom 0.254: v67.78,50.16 U$2.27 | v115.41,31.11 114.14,31.11 114.14,48.89 110.33,52.7 JP3.30 | v115.41,28.57 114.77,29.2 112.23,29.2 110.33,31.11 v104.61,31.11 | v84.92,5.08 v101.44,5.08 | v81.75,22.22 69.05,22.22 67.78,23.49 U$1.35
N$1  (via drill 0.61)
  Top 0.254: v46.19,26.66 45.55,27.3 45.55,35.55 46.19,36.19 v46.19,60.95 | v88.73,69.84 88.1,70.48 IC2.20
  Bottom 0.254: v46.19,26.66 45.55,27.3 39.84,27.3 39.84,24.76 36.66,21.59 30.31,21.59 IC3.4 | v46.19,60.95 53.17,67.94 86.83,67.94 v88.73,69.84
N$2
  Top 0.254: IC12.1 42.38,52.7 43.65,53.97 IC11.6
N$3  (via drill 0.61)
  Top 0.254: v69.05,16.51 v69.05,29.84 | v100.8,17.14 U$1.19
  Bottom 0.254: v100.8,17.14 76.03,17.14 75.4,16.51 v69.05,16.51 | v69.05,29.84 70.32,31.11 IC4.1
N$4  (via drill 0.61)
  Top 0.254: v91.91,7.62 84.29,7.62 84.29,28.57 85.56,29.84 IC4.2
  Bottom 0.254: v91.91,7.62 96.36,7.62 U$1.18
N$5  (via drill 0.61)
  Top 0.254: v94.45,27.93 94.45,12.06 95.72,10.79 U$1.17
  Bottom 0.254: v94.45,27.93 93.18,29.2 90,29.2 IC4.3
N$6  (via drill 0.61)
  Top 0.254: IC3.1 20.79,22.22 19.52,20.95 v19.52,5.08 19.52,4.44 37.94,4.44 39.2,5.71 v39.2,40.63
  Bottom 0.254: v19.52,5.08 16.34,8.25 9.99,8.25 7.45,10.79 7.45,74.29 13.17,74.29 IC10.12 | v39.2,40.63 56.98,40.63 60.8,36.83 83.66,36.83 IC4.15
N$7
  Top 0.254: IC5.1 20.79,10.79 22.06,12.06 22.06,20.95 23.33,22.22 IC3.2
N$8
  Top 0.254: IC6.10 28.41,57.78 25.87,55.24 IC6.4
  Bottom 0.254: IC6.3 23.96,50.8 25.23,50.8 IC6.4
N$9
  Bottom 0.254: IC5.3 27.77,7.62 29.04,7.62 IC5.5
N$10
  Top 0.254: 26.5,49.52 24.6,49.52 24.6,53.97 20.79,57.78 IC6.13 | 26.5,49.52 IC6.5 | IC5.4 28.41,10.79 32.22,14.6 32.22,20.95 33.49,22.22 IC3.6 27.14,29.84 27.14,48.89 26.5,49.52
N$11
  Bottom 0.254: IC6.2 22.7,53.34 29.04,53.34 IC6.6
N$12  (via drill 0.61)
  Top 0.254: v34.76,49.52 34.76,33.65 36.03,32.38 IC3.8
  Bottom 0.254: IC6.9 32.86,60.95 34.76,60.95 v34.76,49.52 20.16,49.52 IC6.1
N$13
  Top 0.254: IC3.10 30.95,32.38 32.22,33.65 32.22,46.35 29.68,48.89 29.68,64.13 23.33,70.48 IC10.9
N$14
  Bottom 0.254: IC6.12 25.23,57.15 31.59,57.15 IC6.8
N$15  (via drill 0.61)
  Top 0.254: v46.83,33.02 47.46,33.65 IC9.3
  Bottom 0.254: v46.83,33.02 25.23,33.02 IC3.13
N$16
  Top 0.254: IC6.11 22.06,62.86 22.06,69.21 20.79,70.48 IC10.10
N$17  (via drill 0.61)
  Top 0.254: v11.9,43.81 11.9,59.69 14.44,62.23 14.44,66.67 18.25,70.48 IC10.11
  Bottom 0.254: v11.9,43.81 11.9,26.66 12.54,26.03 23.33,26.03 IC3.11
N$18  (via drill 0.61)  (1 unrouted)
  Top 0.254: v85.56,34.28 85.56,34.92 83.02,37.46 IC4.16 | v28.41,34.28 IC8.5 | 33.49,65.4 30.95,67.94 IC11.14 | IC6.14 18.25,57.78 22.06,53.97 22.06,36.19 21.42,35.55 21.42,33.02 20.79,32.38 IC3.14 20.79,29.2 22.06,27.93 22.06,22.22 21.42,21.59 21.42,19.05 20.79,18.41 IC5.14 | 41.11,60.32 v39.84,61.59 38.57,62.86 | 41.11,60.32 IC12.14 42.38,65.4 43.65,66.67 | 41.11,60.32 41.11,47.62 42.38,46.35 IC9.14 42.38,43.81 43.65,42.54 43.65,24.76 45.55,24.76 46.83,26.03 | 67.78,55.24 66.51,56.51 66.51,60.32 67.78,61.59 67.78,62.23 | 67.78,62.23 IC2.28 | v67.14,62.23 67.78,62.23 | v56.35,85.72 55.08,84.45 55.08,82.55 50.63,78.1 47.46,78.1 47.46,70.48 43.65,66.67 | 43.65,66.67 v43.02,67.31
  Bottom 0.254: 109.05,33.65 107.78,34.92 99.53,34.92 98.89,34.28 v85.56,34.28 | 17.62,19.68 19.52,17.77 20.16,17.77 IC5.14 | 17.62,28.57 19.52,30.48 20.16,30.48 IC3.14 23.33,33.65 27.77,33.65 v28.41,34.28 | IC6.14 20.79,61.59 v39.84,61.59 | IC10.14 12.54,69.84 29.04,69.84 IC11.14 35.39,67.31 v43.02,67.31 | 56.35,90.8 52.54,90.8 | 56.35,90.8 75.4,90.8 IC1.20 | 58.89,55.88 45.55,55.88 IC12.14 | 58.89,55.88 64.6,55.88 | v67.14,62.23 66.51,61.59 64.6,61.59 58.89,55.88 | v56.35,85.72 56.35,90.8
N$19  (via drill 0.61)
  Top 0.254: v70.32,6.34 70.32,2.54 66.51,2.54 65.24,3.8 U$1.5 | v98.26,6.34 99.53,7.62 v99.53,13.33 | v110.96,13.33 112.23,14.6 112.23,24.12 111.59,24.76 111.59,48.26 v112.23,48.89
  Bottom 0.254: v70.32,6.34 70.95,5.71 84.29,5.71 84.92,6.34 v98.26,6.34 | v99.53,13.33 v110.96,13.33 | v112.23,48.89 110.96,50.16 JP3.32
N$20  (via drill 0.61)
  Top 0.254: 37.94,6.98 28.41,6.98 27.14,8.25 27.14,20.95 25.87,22.22 IC3.3 | 37.94,6.98 v37.94,48.89 | v107.78,3.17 105.88,1.26 61.43,1.26 v61.43,3.17 | 37.94,6.98 v37.94,5.71 | v88.1,48.89 U$2.20
  Bottom 0.254: v37.94,48.89 38.57,49.52 45.55,49.52 IC12.3 | v88.1,48.89 103.97,48.89 104.61,49.52 105.88,49.52 106.52,48.89 110.33,48.89 113.5,45.72 113.5,29.84 115.41,29.84 118.58,26.66 118.58,10.15 114.77,10.15 v107.78,3.17 | v61.43,3.17 58.89,5.71 v37.94,5.71
N$23
  Top 0.254: IC3.12 IC8.4 IC8.13
N$24
  Top 0.254: IC8.16 18.25,46.35 14.44,50.16 14.44,50.8 13.17,52.06 JP1.35
N$25
  Bottom 0.254: IC8.15 17.62,48.26 15.71,48.26 13.8,50.16 JP1.33
N$26  (via drill 0.61)
  Top 0.254: v32.22,53.34 32.22,47.62 33.49,46.35 IC8.10
  Bottom 0.254: v32.22,53.34 31.59,53.97 12.54,53.97 11.26,52.7 JP1.36
N$27  (via drill 0.61)
  Top 0.254: v18.25,48.89 14.44,52.7 14.44,53.34 13.17,54.6 JP1.37
  Bottom 0.254: v18.25,48.89 33.49,48.89 36.03,46.35 IC8.9
N$28  (via drill 0.61)
  Top 0.254: v36.03,41.91 IC8.8
  Bottom 0.254: v36.03,41.91 18.25,41.91 13.8,46.35 9.99,46.35 9.36,46.98 9.36,55.24 JP1.38
N$29
  Top 0.254: R14.2 16.98,31.75 16.34,32.38 16.34,35.55 14.44,37.46 JP1.23
  Bottom 0.254: IC9.6 53.17,39.36 15.71,39.36 13.8,37.46 JP1.23
N$30
  Top 0.254: R13.2 16.98,22.86 15.71,24.12 15.71,29.2 16.34,29.84 18.25,29.84 18.25,34.92 13.8,39.36 13.8,40 JP1.25
  Bottom 0.254: IC9.8 54.45,41.91 37.3,41.91 35.39,40 JP1.25
N$31
  Top 0.254: R1.1 44.92,82.55 41.74,79.37 41.74,77.47 D1.A
  Bottom 0.254: Q1.3 18.88,76.83 20.16,75.56 38.57,75.56 39.84,76.83 D1.A
N$32
  Bottom 0.254: R1.2 44.28,88.26 43.02,89.53 13.17,89.53 8.72,85.08 8.72,81.91 13.8,81.91 15.07,83.18 X1.3
N$33
  Top 0.254: IC10.1 10.63,65.4 8.72,67.31 8.72,85.08 18.88,95.25 63.97,95.25 63.97,89.53 S1.1
N$35
  Bottom 0.254: X1.7 X1.8
N$36
  Bottom 0.254: X1.2 13.17,83.81 13.8,84.45 18.88,84.45 19.52,85.08 X1.9
N$37
  Top 0.254: JP2.7 JP2.5 JP2.3 JP2.1 | 43.02,88.26 44.92,90.17 53.81,90.17 R2.1
  Bottom 0.254: 45.55,80 50,80 53.17,83.18 R2.1 | 45.55,80 24.6,80 21.42,76.83 Q1.1 | 45.55,80 50.63,74.92 56.35,74.92 56.98,74.29 JP2.1
N$40
  Top 0.254: Q2.1 36.03,77.47 37.3,78.73 R3.1
  Bottom 0.254: X1.4 18.88,82.55 20.79,80.64 34.12,80.64 36.66,83.18 R3.1
N$41
  Top 0.254: Q3.3 25.87,79.37 26.5,80 31.59,80 31.59,76.83 32.86,75.56 39.2,75.56 39.2,80.64 41.11,82.55 R5.1
N$42
  Top 0.254: R4.1 33.49,82.55 34.76,81.28 Q2.2
  Bottom 0.254: Q3.1 29.04,76.83 30.95,78.73 Q2.2
N$43  (via drill 0.61)
  Top 0.254: v23.33,84.45 23.33,77.47 19.52,73.66 19.52,66.67 20.79,65.4 IC10.5
  Bottom 0.254: v23.33,84.45 27.14,88.26 31.59,88.26 35.39,84.45 60.8,84.45 63.97,81.28 S1.3
N$46
  Bottom 0.254: IC10.2 15.07,66.03 21.42,66.03 IC10.6
OUT  (via drill 0.61)
  Top 0.254: v36.66,19.68 37.3,19.05 37.3,14.6 33.49,10.79 IC5.6 | v44.92,26.03 IC9.2 | v116.67,64.13 116.67,61.59 117.94,60.32 117.94,20.31 v116.67,19.05
  Bottom 0.254: v36.66,19.68 43.02,26.03 v44.92,26.03 54.45,16.51 58.89,16.51 60.16,17.77 69.05,17.77 69.69,17.14 74.77,17.14 75.4,17.77 98.89,17.77 100.8,19.68 116.04,19.68 v116.67,19.05 | IC9.4 48.09,35.55 46.83,35.55 IC9.2 | v116.67,64.13 109.05,64.13 107.78,62.86 JP3.21
PORT1  (via drill 0.61)
  Top 0.254: v104.61,48.26 105.25,48.89 105.25,57.78 107.15,59.69 JP3.23 | IC4.14 v88.1,42.54
  Bottom 0.254: v88.1,42.54 89.37,43.81 89.37,48.26 v104.61,48.26
PORT2
  Bottom 0.254: 88.1,36.19 87.47,35.55 85.56,35.55 84.92,34.92 44.92,34.92 IC9.1 | 88.1,36.19 IC4.13 | 88.1,36.19 108.42,36.19 108.42,40.63 109.05,41.27 110.96,41.27 110.96,45.72 110.33,46.35 109.05,46.35 107.78,45.08 JP3.35
PORT3  (via drill 0.61)
  Top 0.254: IC9.10 IC9.5 52.54,36.19 53.81,34.92 v53.81,22.86 | v99.53,19.68 99.53,40 v100.8,41.27
  Bottom 0.254: IC4.12 95.72,41.27 v100.8,41.27 105.25,41.27 106.52,42.54 JP3.37 | v53.81,22.86 57.62,19.05 74.13,19.05 74.77,19.68 96.99,19.68 98.26,18.41 v99.53,19.68
PORT4
  Bottom 0.254: IC4.11 97.62,36.83 103.34,36.83 106.52,40 JP3.39
PORT5  (via drill 0.61)
  Top 0.254: v100.8,42.54 98.26,40 IC4.10
  Bottom 0.254: v100.8,42.54 102.07,43.81 107.78,43.81 109.05,45.08 JP3.36
PORT6
  Bottom 0.254: IC4.9 102.7,40.63 105.88,40.63 106.52,41.27 107.78,41.27 109.05,42.54 JP3.38
PORT7
  Bottom 0.254: IC4.7 100.17,33.02 105.88,33.02 106.52,32.38 110.33,32.38 110.96,33.02 110.96,39.36 109.69,39.36 JP3.40
Q  (via drill 0.61)
  Top 0.254: U$1.4 62.7,5.71 58.26,1.26 42.38,1.26 v42.38,34.28 42.38,34.92 40.47,36.83 40.47,59.69 37.3,62.86 37.3,73.02 35.39,74.92 27.14,74.92 Q3.2 | v91.91,33.02 v91.91,46.98
  Bottom 0.254: v91.91,46.98 105.88,46.98 106.52,47.62 JP3.33 | v91.91,33.02 48.09,33.02 46.83,34.28 v42.38,34.28
RESET  (via drill 0.61)
  Top 0.254: IC10.3 16.34,63.49 17.62,63.49 IC10.4 | v9.36,59.05 8.72,58.41 8.72,9.52 9.99,8.25 12.54,8.25 12.54,9.52 JP1.1
  Bottom 0.254: IC11.1 29.04,62.23 20.16,62.23 IC10.4 | U$1.3 58.26,7.62 42.38,7.62 38.57,11.43 15.71,11.43 13.8,9.52 JP1.1 | v9.36,59.05 10.63,59.05 IC10.3
SC0  (via drill 0.61)
  Top 0.254: v70.95,48.89 71.59,48.26 71.59,14.6 67.78,10.79 U$1.6
  Bottom 0.254: v70.95,48.89 71.59,48.26 79.21,48.26 81.75,50.8 102.7,50.8 103.34,51.43 105.25,51.43 106.52,50.16 JP3.31
TPA  (via drill 0.61)
  Top 0.254: IC1.11 100.8,86.99 103.34,84.45 103.34,76.19 105.88,73.66 105.88,72.39 106.52,71.75 108.42,71.75 108.42,69.84 107.15,68.58 JP3.17 | v70.32,28.57 U$1.34 | v81.75,92.7 79.21,95.25 70.32,95.25 70.32,79.37 65.24,74.29 v65.24,29.2
  Bottom 0.254: 65.24,28.57 v70.32,28.57 | 65.24,28.57 36.03,28.57 IC3.9 | v81.75,92.7 96.36,92.7 IC1.11 | 65.24,28.57 v65.24,29.2
TPB  (via drill 0.61)
  Top 0.254: v114.77,67.94 114.14,68.58 114.14,85.72 v109.69,90.17 | v55.08,76.19 48.73,69.84 48.73,28.57 v47.46,27.3
  Bottom 0.254: 47.46,27.93 69.69,27.93 U$1.33 | 47.46,27.93 35.39,27.93 IC3.5 | v109.69,90.17 109.05,89.53 104.61,89.53 100.17,85.08 85.56,85.08 83.02,82.55 79.84,82.55 79.21,81.91 79.21,79.37 76.03,76.19 v55.08,76.19 | 47.46,27.93 v47.46,27.3 | v114.77,67.94 JP3.18
VCC  (via drill 0.61)  (1 unrouted)
  Top 0.254: R6.2 R7.2 R8.2 R9.2 R10.2 R11.2 R12.2 | R13.1 16.98,20.31 18.25,21.59 18.25,26.66 16.98,27.93 R14.1 | SV1.1 50,85.08 48.73,83.81 R2.2 48.73,82.55 44.92,78.73 44.92,70.48 IC11.4 | v16.98,16.51 16.98,5.71 18.88,3.8 v41.11,3.8 | v52.54,4.44 U$1.2 57.62,10.79 55.08,13.33 U$1.40 55.08,26.03 54.45,26.66 54.45,35.55 53.81,36.19 v53.81,54.6
  Bottom 0.254: U$1.40 53.81,26.03 QG1.14 | 95.08,11.43 95.72,12.06 107.78,12.06 109.05,10.79 R6.2 | 95.08,11.43 U$1.16 | 95.08,11.43 59.52,11.43 U$1.2 | IC11.2 35.39,62.23 36.66,62.23 IC11.4 40.47,62.23 41.11,62.23 41.11,57.78 43.65,55.24 53.81,55.24 | v41.11,3.8 41.74,4.44 v52.54,4.44 | v16.98,16.51 R13.1 | 53.81,55.24 65.24,55.24 U$2.28 | R5.2 41.74,88.26 43.02,86.99 50,86.99 SV1.1 | v53.81,54.6 53.81,55.24

### Text on the board
Top: (c) 2004 MIchael H Riley | Pico/Elf